# EAGLE schematic tetris_big_noregulator_PCBUSB (EAGLE 6.2)
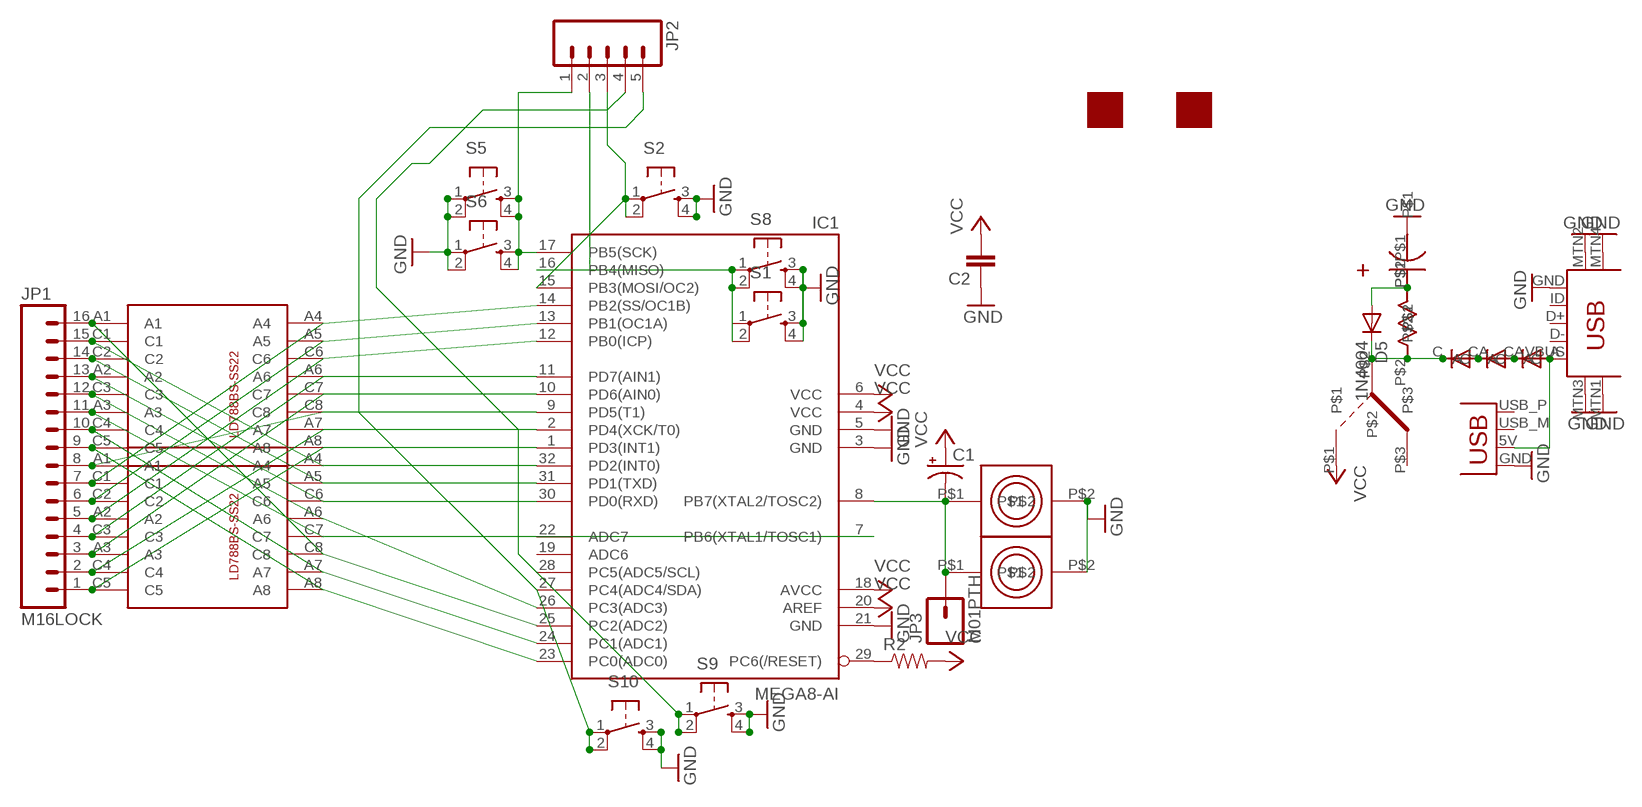
[diagram p0: schematic, sheet 1]

## Parts
C1  CAP_POLPTH1  [CPOL-RADIAL-100UF-25V]
C2  C-EU025-025X050  [C025-025X050]
D5  1N4004  [DO41-10]
IC1  MEGA8-AI  [TQFP32-08]
JP1  M16LOCK  [1X16_LOCK]
JP2  M05LOCK  [1X05_LOCK]
JP3  M01PTH  [1X01]
R2  RESISTORPTH1  [AXIAL-0.3]
S1  TAC_SWITCHPTH  [TACTILE-PTH]
S2  TAC_SWITCHPTH  [TACTILE-PTH]
S5  TAC_SWITCHPTH  [TACTILE-PTH]
S6  TAC_SWITCHPTH  [TACTILE-PTH]
S8  TAC_SWITCHPTH  [TACTILE-PTH]
S9  TAC_SWITCHPTH  [TACTILE-PTH]
S10  TAC_SWITCHPTH  [TACTILE-PTH]
U$1  LD-1088BS  [LD-1088BS]
U$2  LD-1088BS  [LD-1088BS]
U$3  LOGO  [LOGO]
U$4  I-80450RF  [ISK4.1K_I-80450RF_I2G]
U$5  NICHICON_12F  [NICHICON_10X30]
U$6  LOGO  [LOGO]
U$7  PIEZO_ROUND_PTH  [PIEZO_ROUND_ENCASED_PTH]
U$8  R-7  [R-7]
U$9  SPST_BIG_PTH  [SWITCH_BIG]
U$10  D-6  [D-7.5]
U$11  D-6  [D-7.5]
U$12  D-6  [D-7.5]
X1  USB-MINIB-5PIN  [USB-MINIB]
X2  USBPCB  [USB-A-PCB]

## Nets
GND: C2.1 IC1.3(GND) IC1.5(GND) IC1.21(GND) S1.3 S1.4 S2.3 S2.4 S5.1 S5.2 S6.1 S6.2 S8.3 S8.4 S9.3 S9.4 S10.3 S10.4 U$4.P$2 U$5.P$1 U$7.P$2 X1.GND X1.MTN1(MTN2) X1.MTN2(MTN3) X1.MTN3(MTN1) X1.MTN4 X2.GND
N$1: IC1.32(PD2(INT0)) JP1.15 U$1.A4 U$2.C1
N$2: IC1.31(PD1(TXD)) JP1.14 U$1.A5 U$2.C2
N$3: IC1.30(PD0(RXD)) JP1.13 U$1.C6 U$2.A2
N$4: IC1.26(PC3(ADC3)) JP1.12 U$1.A6 U$2.C3
N$5: IC1.7(PB6(XTAL1/TOSC1)) JP1.11 U$1.C7 U$2.A3
N$6: IC1.24(PC1(ADC1)) JP1.10 U$1.A7 U$2.C4
N$7: IC1.23(PC0(ADC0)) JP1.9 U$1.A8 U$2.C5
N$8: IC1.25(PC2(ADC2)) JP1.16 U$1.C8 U$2.A1
N$9: U$10.A X1.VBUS X2.5V(VBUS)
N$10: IC1.13(PB1(OC1A)) JP1.6 U$1.C2 U$2.A5
N$11: IC1.12(PB0(ICP)) JP1.5 U$1.A2 U$2.C6
N$12: IC1.11(PD7(AIN1)) JP1.4 U$1.C3 U$2.A6
N$13: IC1.10(PD6(AIN0)) JP1.3 U$1.A3 U$2.C7
N$14: IC1.9(PD5(T1)) JP1.8 U$1.A1 U$2.C8
N$15: IC1.2(PD4(XCK/T0)) JP1.2 U$1.C4 U$2.A7
N$16: IC1.1(PD3(INT1)) JP1.1 U$1.C5 U$2.A8
N$17: C1.2(-) IC1.8(PB7(XTAL2/TOSC2)) JP3.1 U$4.P$1 U$7.P$1
N$18: U$10.C U$11.A
N$19: U$11.C U$12.A
N$20: IC1.27(PC4(ADC4/SDA)) JP2.5 S10.1 S10.2
N$21: IC1.28(PC5(ADC5/SCL)) JP2.4 S9.1 S9.2
N$22: IC1.15(PB3(MOSI/OC2)) JP2.3 S2.1 S2.2
N$23: IC1.16(PB4(MISO)) JP2.2 S1.1 S1.2 S8.1 S8.2
N$24: D5.C U$8.P$2 U$9.P$2 U$12.C
N$25: D5.A U$5.P$2 U$8.P$1
N$26: IC1.17(PB5(SCK)) JP2.1 S5.3 S5.4 S6.3 S6.4
N$28: IC1.14(PB2(SS/OC1B)) JP1.7 U$1.C1 U$2.A4
N$29: IC1.29(PC6(/RESET)) R2.P$1
VCC: C1.1(+) C2.2 IC1.4(VCC) IC1.6(VCC) IC1.18(AVCC) IC1.20(AREF) R2.P$2 U$9.P$1
Unconnected: IC1.19(ADC6) IC1.22(ADC7) U$9.P$3 X1.D+ X1.D- X1.ID X2.USB_M(D-) X2.USB_P(D+)

## Library data of the parts
C1 = SparkFun:CAP_POL: Capacitor Polarized These are standard SMD and PTH capacitors. Normally 10uF, 47uF, and 100uF in electrolytic and tantalum varieties. Always verify the external diameter of the through hole cap, it varies with capacity, voltage, and manufacturer. The EIA devices should be standard.
C2 = rcl:C-EU: CAPACITOR, European symbol
D5 = adafruit:1N4004: DIODE General purpose 1N400x type rectifier (With bigger pads) http://www.ladyada.net/library/pcb/eaglelibrary.html
IC1 = atmel:MEGA8: MICROCONTROLLER 8 Kbytes FLASH, 1 kbytes SRAM, 512 bytes EEPROM, USART, 6-channel 10 bit ADC, 2-channel 8 bit ADC Pin compatible with Atmega48, ATMega88, ATMega168 Source: avr.lbr; MPN: ATMEGA8-16AU; OC_FARNELL: 9171371; OC_NEWARK: 73M8863
JP1 = SparkFun-Connectors:M16: 1x16 .1" header
JP2 = SparkFun-Connectors:M05: Header 5 Standard 5-pin 0.1" header. Use with straight break away headers (SKU : PRT-00116), right angle break away headers (PRT-00553), swiss pins (PRT-00743), machine pins (PRT-00117), and female headers (PRT-00115). Molex polarized connector foot print use with SKU : PRT-08230 with associated crimp pins and housings.
JP3 = SparkFun-Connectors:M01: Header 1 Standard 1-pin 0.1" header. Use with straight break away headers (SKU : PRT-00116), right angle break away headers (PRT-00553), swiss pins (PRT-00743), machine pins (PRT-00117), and female headers (PRT-00115).
R2 = SparkFun:RESISTOR: Resistor Basic schematic elements and footprints for 0603, 1206, and PTH 1/10th watt (small) resistors.
S1 S2 S5 S6 S8-S10 = SparkFun-Electromechanical:TAC_SWITCH: Momentary Switch Button commonly used for reset or general input. Spark Fun Electronics SKU : COM-00097 SMT- SWCH-08247
U$1 U$2 = mrule:LD-1088BS
U$3 U$6 = mrule2:LOGO
U$4 = mrule:I-80450RF
U$5 = mrule:NICHICON_12F
U$7 = mrule:PIEZO_ROUND_PTH
U$8 = mrule:R-7
U$9 = mrule:SPST_BIG_PTH
U$10-U$12 = mrule:D-6
X1 = SparkFun:USB-MINIB: Mini-USB "B" connector with 5th pin broken out. Created new symbol breaking out 5th "ID" pin in mini/micro USB connector spec. See: http://en.wikipedia.org/wiki/Mini_usb#Cables. Uses same footprint as 4-pin symbol. Also added pins to connect to mounting / shield pads if required (probably not generally needed as signals aren't shielded once they leave the connector).
X2 = SparkFun:USB: USB Connectors USB-B-PTH is fully proven SKU : PRT-00139 USB-miniB is fully proven SKU : PRT-00587 USB-A-PCB is untested. USB-A-H is throughly reviewed, but untested. Spark Fun Electronics SKU : PRT-00437 USB-B-SMT is throughly reviewed, but untested. Needs silkscreen touching up. USB-A-S has not been used/tested USB-MB-H has not been used/tested